# EAGLE design pic32mcj048 (EAGLE 9.6.2)
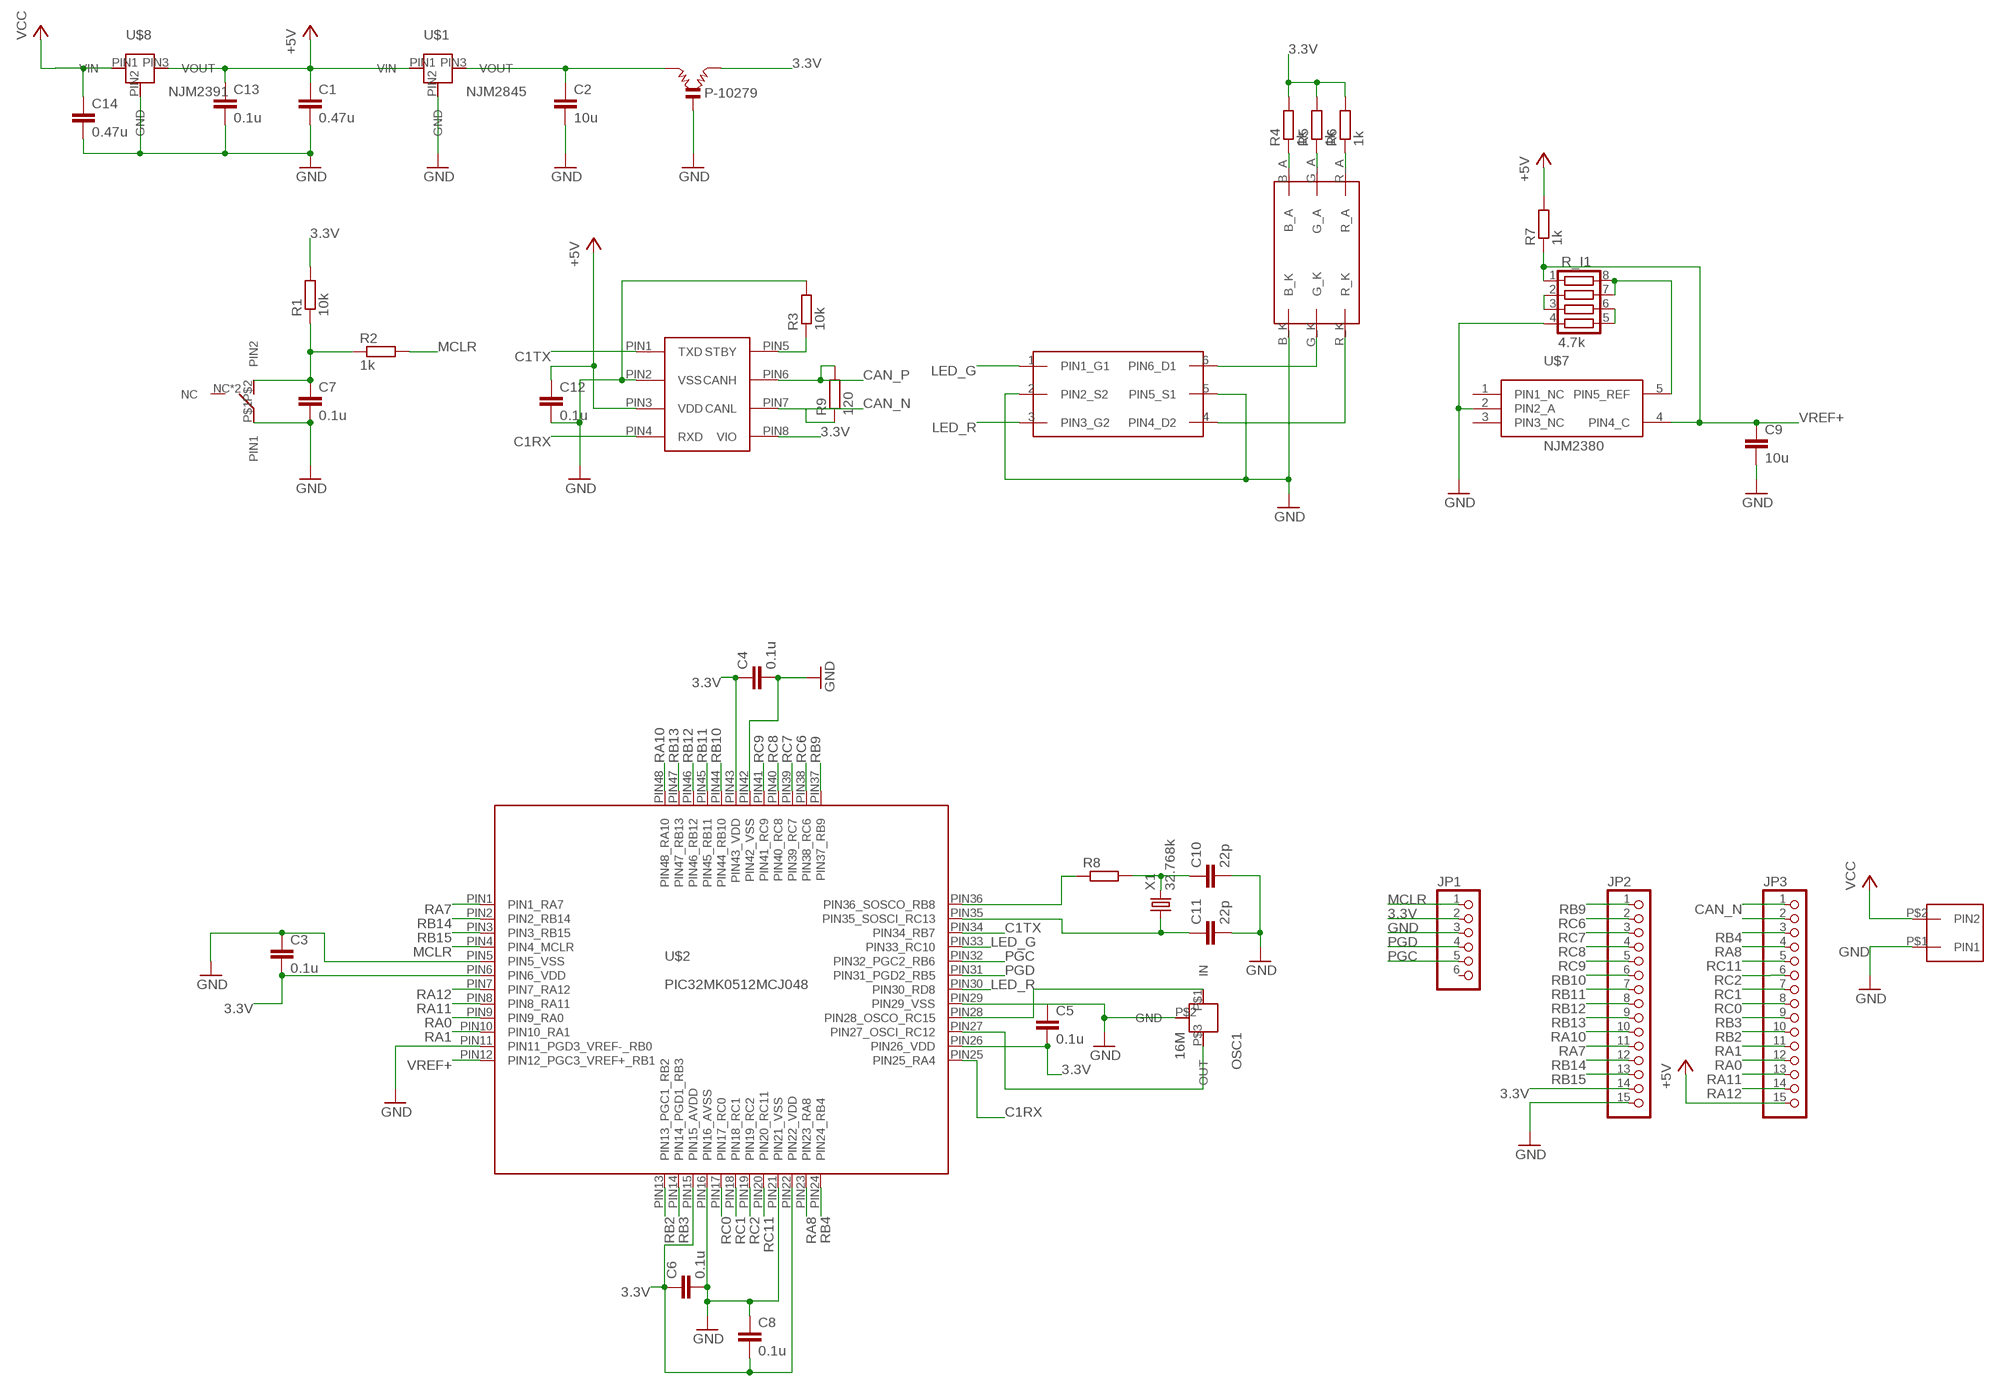
[diagram p0: schematic, sheet 1]

## Parts
C1  0.47u  C-EUC1608  [C1608]
C2  10u  C-EUC1608  [C1608]
C3  0.1u  C-EUC1608  [C1608]
C4  0.1u  C-EUC1608  [C1608]
C5  0.1u  C-EUC1608  [C1608]
C6  0.1u  C-EUC1608  [C1608]
C7  0.1u  C-EUC1608  [C1608]
C8  0.1u  C-EUC1608  [C1608]
C9  10u  C-EUC1608  [C1608]
C10  22p  C-EUC1608  [C1608]
C11  22p  C-EUC1608  [C1608]
C12  0.1u  C-EUC1608  [C1608]
C13  0.1u  C-EUC1608  [C1608]
C14  0.47u  C-EUC1608  [C1608]
IC1  MCP2562  [DIL8]
JP1  PINHD-1X6  [1X06]
JP2  PINHD-1X15  [1X15]
JP3  PINHD-1X15  [1X15]
OSC1  16M  CSTN#  [CSTNE#]
P-10279  LCL  [LCL]
R1  10k  R_REG  [1608]
R2  1k  R_REG  [1608]
R3  10k  R_REG  [1608]
R4  1k  R_REG  [1608]
R5  1k  R_REG  [1608]
R6  1k  R_REG  [1608]
R7  1k  R_REG  [1608]
R8  R_REG  [1608]
R9  120  R_REG  [1608]
R_I1  4.7k  R_SHUGOU2  [1005X4RESISTOR]
U$1  NJM2845  [TO252]
U$2  PIC32MK0512MCJ048  [LQFP48PIN]
U$3  TAKUTOSUITTI2  [TAKUTOSUITTI2]
U$4  XH_2P  [XH_2P]
U$5  RGB_LED  [RGB_LED]
U$6  FDC6305  [SSOT6]
U$7  NJM2380  [SOT23-5]
U$8  NJM2391  [TO252]
X1  32.768k  FC255  [FC255]

## Nets
3.3V: C3.2 C4.1 C5.2 C6.1 C8.2 IC1.PIN8(VIO) JP1.2 JP2.14 P-10279.2 R1.2 R4.2 R5.2 R6.2 U$2.PIN6(PIN6_VDD) U$2.PIN15(PIN15_AVDD) U$2.PIN22(PIN22_VDD) U$2.PIN26(PIN26_VDD) U$2.PIN43(PIN43_VDD)
+5V: C1.1 C12.1 C13.1 IC1.PIN3(VDD) JP3.15 R7.2 U$1.PIN1(VIN) U$8.PIN3(VOUT)
C1RX: IC1.PIN4(RXD) U$2.PIN25(PIN25_RA4)
C1TX: IC1.PIN1(TXD) U$2.PIN34(PIN34_RB7)
CAN_N: IC1.PIN7(CANL) JP3.1 R9.1
CAN_P: IC1.PIN6(CANH) JP3.2 R9.2
GND: C1.2 C2.2 C3.1 C4.2 C5.1 C6.2 C7.2 C8.1 C9.2 C10.2 C11.2 C12.2 C13.2 C14.2 IC1.PIN2(VSS) JP1.3 JP2.15 OSC1.P$2(GND) P-10279.0(GND) R3.2 R_I1.4 U$1.PIN2(GND) U$2.PIN5(PIN5_VSS) U$2.PIN11(PIN11_PGD3_VREF-_RB0) U$2.PIN16(PIN16_AVSS) U$2.PIN21(PIN21_VSS) U$2.PIN29(PIN29_VSS) U$2.PIN42(PIN42_VSS) U$3.P$1(PIN1) U$4.P$1(PIN1) U$5.B_K U$6.2(PIN2_S2) U$6.5(PIN5_S1) U$7.2(PIN2_A) U$8.PIN2(GND)
LED_G: U$2.PIN33(PIN33_RC10) U$6.1(PIN1_G1)
LED_R: U$2.PIN30(PIN30_RD8) U$6.3(PIN3_G2)
MCLR: JP1.1 R2.2 U$2.PIN4(PIN4_MCLR)
N$1: C2.1 P-10279.1 U$1.PIN3(VOUT)
N$2: C7.1 R1.1 R2.1 U$3.P$2(PIN2)
N$3: OSC1.P$1(IN) U$2.PIN28(PIN28_OSCO_RC15)
N$4: OSC1.P$3(OUT) U$2.PIN27(PIN27_OSCI_RC12)
N$5: IC1.PIN5(STBY) R3.1
N$6: C10.1 R8.2 X1.P$2
N$7: C11.1 U$2.PIN35(PIN35_SOSCI_RC13) X1.P$1
N$8: U$5.G_K U$6.6(PIN6_D1)
N$9: U$5.R_K U$6.4(PIN4_D2)
N$11: R8.1 U$2.PIN36(PIN36_SOSCO_RB8)
N$13: R4.1 U$5.B_A
N$14: R5.1 U$5.G_A
N$15: R6.1 U$5.R_A
N$21: R_I1.7 R_I1.8 U$7.5(PIN5_REF)
N$45: R_I1.2 R_I1.3
N$46: R_I1.5 R_I1.6
PGC: JP1.5 U$2.PIN32(PIN32_PGC2_RB6)
PGD: JP1.4 U$2.PIN31(PIN31_PGD2_RB5)
RA0: JP3.12 U$2.PIN9(PIN9_RA0)
RA1: JP3.11 U$2.PIN10(PIN10_RA1)
RA7: JP2.11 U$2.PIN1(PIN1_RA7)
RA8: JP3.4 U$2.PIN23(PIN23_RA8)
RA10: JP2.10 U$2.PIN48(PIN48_RA10)
RA11: JP3.13 U$2.PIN8(PIN8_RA11)
RA12: JP3.14 U$2.PIN7(PIN7_RA12)
RB2: JP3.10 U$2.PIN13(PIN13_PGC1_RB2)
RB3: JP3.9 U$2.PIN14(PIN14_PGD1_RB3)
RB4: JP3.3 U$2.PIN24(PIN24_RB4)
RB9: JP2.1 U$2.PIN37(PIN37_RB9)
RB10: JP2.6 U$2.PIN44(PIN44_RB10)
RB11: JP2.7 U$2.PIN45(PIN45_RB11)
RB12: JP2.8 U$2.PIN46(PIN46_RB12)
RB13: JP2.9 U$2.PIN47(PIN47_RB13)
RB14: JP2.12 U$2.PIN2(PIN2_RB14)
RB15: JP2.13 U$2.PIN3(PIN3_RB15)
RC0: JP3.8 U$2.PIN17(PIN17_RC0)
RC1: JP3.7 U$2.PIN18(PIN18_RC1)
RC2: JP3.6 U$2.PIN19(PIN19_RC2)
RC6: JP2.2 U$2.PIN38(PIN38_RC6)
RC7: JP2.3 U$2.PIN39(PIN39_RC7)
RC8: JP2.4 U$2.PIN40(PIN40_RC8)
RC9: JP2.5 U$2.PIN41(PIN41_RC9)
RC11: JP3.5 U$2.PIN20(PIN20_RC11)
VCC: C14.1 U$4.P$2(PIN2) U$8.PIN1(VIN)
VREF+: C9.1 R7.1 R_I1.1 U$2.PIN12(PIN12_PGC3_VREF+_RB1) U$7.4(PIN4_C)
Unconnected: JP1.6 U$3.NC U$3.NC@2(NC) U$7.1(PIN1_NC) U$7.3(PIN3_NC)

## Library data of the parts
C1-C14 = rcl:C-EU: CAPACITOR, European symbol; SPICEPREFIX: C
IC1 = user_ic:MCP2562
JP1 = pinhead:PINHD-1X6: PIN HEADER
JP2 JP3 = pinhead:PINHD-1X15: PIN HEADER
OSC1 = user_osc:CSTN#: ムラタのセラロック （セラミック振動子） 周波数はいくつか種類あり(valueで設定して) 秋月電子通商のトップ/パーツ一般/発振子/セラミック発振子 uCからのoutが入るのがinであることに注意 https://akizukidenshi.com/catalog/c/cceralock/
P-10279 = user_emifilter:LCL: FILTER; MPN: LCL; OC_FARNELL: 106331; OC_NEWARK: 06WX8509
R1-R9 = user_rcl:R_REG: チップ抵抗
R_I1 = user_rcl:R_SHUGOU
U$1 = user_ic:NJM2845: 3.3V800mA NJM2845 低ドロップアウト三端子レギュレータ 秋月電子通商[I-11299]
U$2 = user_ic:PIC32MK0512MCJ048: PIC32MK0512MCJ048 仕様 1. 定格3.3V、32bitMCU、FPU搭載、CAN-FD、QEI 2. モータコントロール向けマイコン
U$3 = user_swich:TAKUTOSUITTI2: 表面実装タクトスイッチ 秋月電子通称通販コード[P-14888]
U$4 = user_conector:XH_2P: トップ型xhコネクタ2ピン 秋月に売ってるやつ
U$5 = user_leds:RGB_LED: 秋月電子通商 I-12726
U$6 = user_tr_fet_igbt:FDC6305: デュアルNchMOSFET ゲート・ソース間絶対最大定格8v 秋月電子通商通販コード[I-06003]
U$7 = user_ic:NJM2380: njm2380af シャントレギュレータ（降伏電圧が可変可能なツナダイオードみたいなもの） ref=2.465(1%) 秋月電子通商[I-14049]
U$8 = user_ic:NJM2391: 5.5V1A NJM2845 低ドロップアウト三端子レギュレータ 秋月電子通商[I-02253]
X1 = user_osc:FC255: 表面実装水晶発振器 32,768kHzの水晶発振器 秋月電子 通販コード:P-03004

## Board
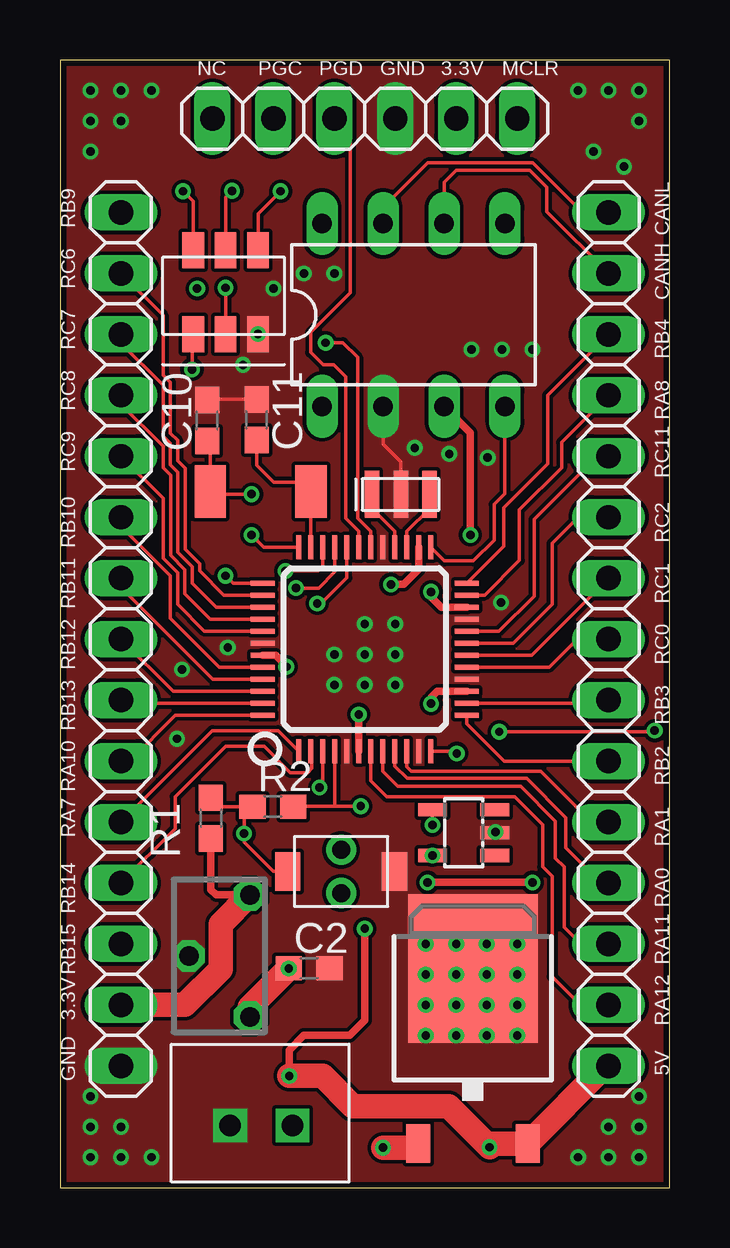
[diagram p1: board, top side]
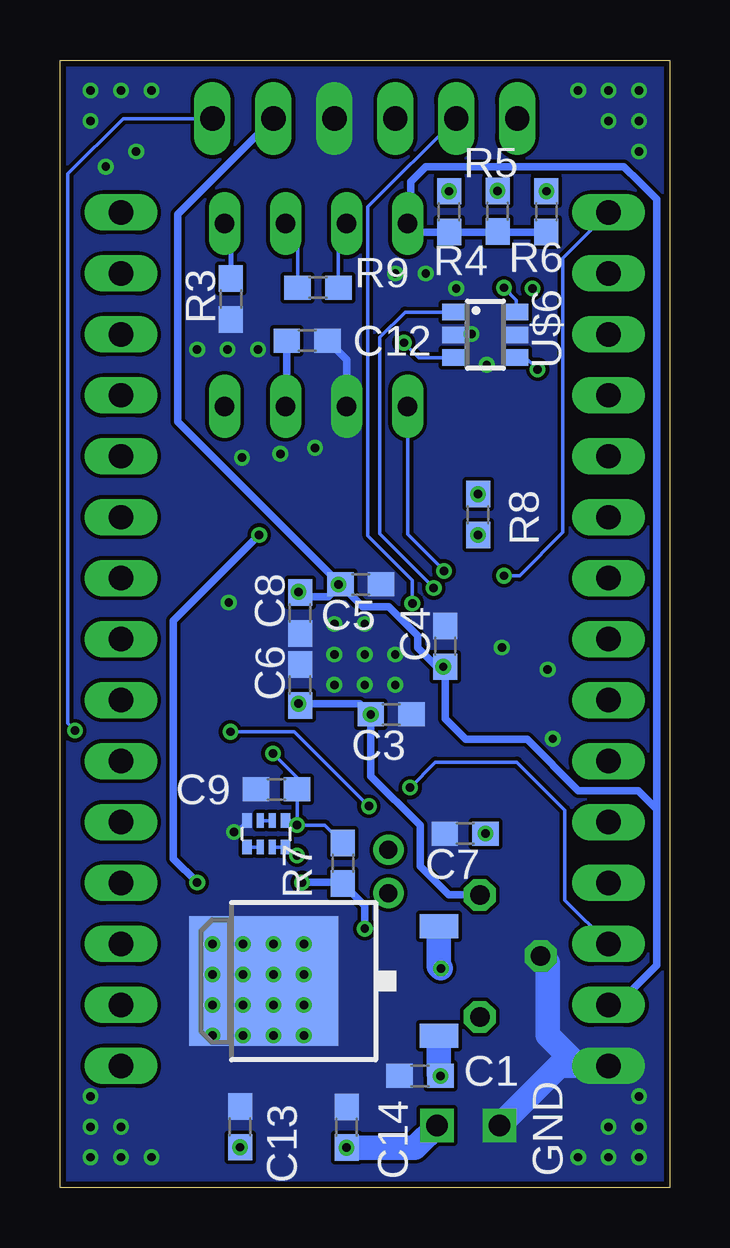
[diagram p2: board, bottom side, seen from below]

Size 25.4 x 46.99 mm. Coordinates in mm from the lower left corner, seen from the top.
Outline: 0,0 25.4,0 25.4,46.99 0,46.99 0,0
Copper layers (1*16): Top 0.035mm / dielectric 1.5mm / Bottom 0.035mm
Design rules "SeeedStudio_2layer_DRU_no_angle_20140221": minimum track width 6mil, minimum drill 12mil, track to track 6mil, track to pad 6mil, pad to pad 6mil, via to via 6mil, smd to smd 0mil, copper to edge 10mil, drill to drill 10mil, minimum pad ring 10mil, minimum via ring 6mil, stop-mask expansion 2mil, vias tented up to drill 100mil, thermal gap 10mil

### Footprints (pad centres in the part's own frame; a part is rotated, then mirrored left to right if it is on the bottom)
C1608 = smd 1.1 x 1: 1 -0.85,0; 2 0.85,0
DIL8 = drill 0.813 long: PIN1 -3.81,-3.81; PIN2 -1.27,-3.81; PIN3 1.27,-3.81; PIN4 3.81,-3.81; PIN5 3.81,3.81; PIN6 1.27,3.81; PIN7 -1.27,3.81; PIN8 -3.81,3.81
1X06 = drill 1.016 long: 1 -6.35,0; 2 -3.81,0; 3 -1.27,0; 4 1.27,0; 5 3.81,0; 6 6.35,0
1X15 = drill 1.016 long: 1 -17.78,0; 2 -15.24,0; 3 -12.7,0; 4 -10.16,0; 5 -7.62,0; 6 -5.08,0; 7 -2.54,0; 8 0,0; 9 2.54,0; 10 5.08,0; 11 7.62,0; 12 10.16,0; 13 12.7,0; 14 15.24,0; 15 17.78,0
CSTNE# = smd 0.6 x 1.95: P$1 0,0; P$2 1.2,0; P$3 2.4,0
LCL = drill 0.813 octagon: 0 0,1.27; 1 -2.54,-1.27; 2 2.54,-1.27
1608 = smd 1.1 x 1: 1 -0.85,0; 2 0.85,0
1005X4RESISTOR = smd 0.4 x 0.6: 1 0.2,-0.8; 4 1.8,-0.8; 5 1.8,0.3; 8 0.2,0.3 | smd 0.3 x 0.6: 2 0.75,-0.8; 3 1.25,-0.8; 6 1.25,0.3; 7 0.75,0.3
TO252 = smd 1 x 1.6: PIN1 -2.28,-4.8; PIN3 2.28,-4.8 | smd 5.4 x 6.2: PIN2 0,2.5
LQFP48PIN = smd 0.2 x 1: PIN1 -2.75,-4.25; PIN2 -2.25,-4.25; PIN3 -1.75,-4.25; PIN4 -1.25,-4.25; PIN5 -0.75,-4.25; PIN6 -0.25,-4.25; PIN7 0.25,-4.25; PIN8 0.75,-4.25; PIN9 1.25,-4.25; PIN10 1.75,-4.25; PIN11 2.25,-4.25; PIN12 2.75,-4.25; PIN25 2.75,4.25; PIN26 2.25,4.25; PIN27 1.75,4.25; PIN28 1.25,4.25; PIN29 0.75,4.25; PIN30 0.25,4.25; PIN31 -0.25,4.25; PIN32 -0.75,4.25; PIN33 -1.25,4.25; PIN34 -1.75,4.25; PIN35 -2.25,4.25; PIN36 -2.75,4.25 | smd 1 x 0.2: PIN13 4.25,-2.75; PIN14 4.25,-2.25; PIN15 4.25,-1.75; PIN16 4.25,-1.25; PIN17 4.25,-0.75; PIN18 4.25,-0.25; PIN19 4.25,0.25; PIN20 4.25,0.75; PIN21 4.25,1.25; PIN22 4.25,1.75; PIN23 4.25,2.25; PIN24 4.25,2.75; PIN37 -4.25,2.75; PIN38 -4.25,2.25; PIN39 -4.25,1.75; PIN40 -4.25,1.25; PIN41 -4.25,0.75; PIN42 -4.25,0.25; PIN43 -4.25,-0.25; PIN44 -4.25,-0.75; PIN45 -4.25,-1.25; PIN46 -4.25,-1.75; PIN47 -4.25,-2.25; PIN48 -4.25,-2.75
TAKUTOSUITTI2 = drill 0.75: NC 2.225,-0.9; NC@2 2.225,0.9 | smd 1.05 x 1.6: P$1 0,0; P$2 4.45,0
XH_2P = drill 0.9 square: P$1 2.45,2.35; P$2 5.05,2.35
RGB_LED = smd 1.5 x 0.9: B_A 3.5,-2.7; B_K 0,-2.7; G_A 3.5,-1.35; G_K 0,-1.35; R_A 3.5,0; R_K 0,0
SSOT6 = smd 0.69 x 0.99: 1 -0.95,-1.3; 2 0,-1.3; 3 0.95,-1.3; 4 0.95,1.3; 5 0,1.3; 6 -0.95,1.3
SOT23-5 = smd 0.55 x 1.2: 1 -0.95,-1.3; 2 0,-1.3; 3 0.95,-1.3; 4 0.95,1.3; 5 -0.95,1.3
FC255 = smd 1.3 x 2.2: P$1 0,0; P$2 4.2,0

### Placement (x,y rotation side)
C1  10.4,4.66 180 bottom
C2  10.38,9.14 0 top
C3  11.6,19.72 180 bottom
C4  9.34,22.56 90 bottom
C5  12.87,25.14 180 bottom
C6  15.39,20.95 90 bottom
C7  8.52,14.76 180 bottom
C8  15.39,23.95 90 bottom
C9  16.38,16.6 180 bottom
C10  6.13,31.97 90 top
C11  8.2,32 90 top
C12  15.1,35.29 0 bottom
C13  17.9,2.54 90 bottom
C14  13.46,2.52 90 bottom
IC1  14.73,36.37 0 top
JP1  12.7,44.55 180 top
JP2  2.54,22.86 270 top
JP3  22.86,22.86 270 top
OSC1  13,28.9 0 top
P-10279  6.64,9.66 90 top
R1  6.28,15.4 270 top
R2  8.87,15.88 0 top
R3  18.29,37.03 270 bottom
R4  9.19,40.67 270 bottom
R5  7.17,40.69 270 bottom
R6  5.13,40.67 270 bottom
R7  13.62,13.52 270 bottom
R8  7.98,28.05 90 bottom
R9  14.65,37.51 180 bottom
R_I1  15.8,14.49 180 bottom
U$1  14.41,8.61 90 bottom
U$2  12.7,22.44 0 top
U$3  13.94,13.18 180 top
U$4  4.64,0.24 0 top
U$5  5.55,35.57 90 top
U$6  7.68,35.54 270 bottom
U$7  16.82,14.79 90 top
U$8  17.2,6.64 0 top
X1  10.46,29.01 180 top

### Tracks (layer width: path | path; a pad name or v marks a point on that pad's centre or on a via)
3.3V  (via drill 0.35)
  Top 0.305: P-10279.2 6.5,12.2 6.28,12.42 R1.2 | v9.43,21.71 9.26,21.89 9.26,21.92 8.98,22.19 U$2.PIN43 | U$2.PIN26 14.95,25.77 14.32,25.14 v13.79,25.14 | v15.46,24.83 15.46,24.61 15.88,24.19 U$2.PIN22 | v15.46,20.17 15.46,20.43 15.72,20.69 U$2.PIN15 | C3.2 U$2.PIN6
  Top 1.016: P-10279.2 6.69,10.98 6.69,9.11 5.2,7.62 JP2.14
  Bottom 0.305: C4.1 9.34,19.54 8.49,18.69 5.94,18.69 3.8,16.55 1.32,16.55 0.54,15.77 | C4.1 v9.43,21.71 | P-10279.2 9.2,12.2 10.4,13.4 10.4,15.1 12.45,17.15 C3.2 12.9,20.17 v15.46,20.17 C6.1 | C5.2 14.23,24.63 15.26,24.63 v15.46,24.83 15.43,24.8 C8.2 | C4.1 9.71,21.71 10.5,22.5 10.5,23 11.7,24.2 12.78,24.2 C5.2 | C6.1 | C5.2 20.49,31.91 20.49,40.57 JP1.2 | R6.2 7.15,39.82 R5.2 7.19,39.82 R4.2 10.56,39.82 IC1.PIN8 10.79,40.3 10.79,41.91 10.16,42.55 1.91,42.55 1.27,41.91 0.54,41.18 0.54,15.77 | C5.2 v13.79,25.14 | JP2.14 2.19,7.62 0.54,9.27 0.54,15.24 0.54,15.77
  other vias: 12.45,19.72
+5V  (via drill 0.35)
  Top 0.305: IC1.PIN3 17.1,31.46 v17.1,27.2 | C1.1 9.55,5.74 10.16,6.35 12.06,6.35 12.7,6.99 v12.7,10.79 | v15.31,12.72 v19.68,12.72
  Top 1.016: C1.1 10.94,4.66 12.2,3.4 16.19,3.4 C13.1 18.05,1.84 U$8.PIN3 22.72,5.08 JP3.15
  Bottom 0.305: C12.1 15.95,32.61 IC1.PIN3 | v17.1,27.2 20.68,23.62 20.68,13.71 v19.68,12.72 | v12.7,10.79 12.7,11.75 R7.2 13.67,12.72 v15.31,12.72
  Bottom 1.016: C1.1 9.61,4.72 U$1.PIN1
  other vias: 17.9,1.69 9.55,4.66
C1RX
  Top 0.152: IC1.PIN4 18.54,28.92 18.09,28.47 18.09,26.99 17.22,26.12 16.02,26.12 U$2.PIN25
C1TX  (via drill 0.35)
  Top 0.152: U$2.PIN34 10.95,25.88 10.77,25.7 v9.4,25.7
  Bottom 0.152: IC1.PIN1 10.92,27.22 v9.4,25.7
CAN_N
  Top 0.152: JP3.1 21.76,40.64 19.7,42.7 15.32,42.7 13.62,40.99 13.62,40.34 IC1.PIN7
  Bottom 0.152: R9.1 13.8,39.84 IC1.PIN7
CAN_P
  Top 0.152: JP3.2 20.28,40.68 20.28,41.68 19.57,42.4 16.5,42.4 16,41.9 IC1.PIN6
  Bottom 0.152: R9.2 15.5,39.68 IC1.PIN6
GND  (via drill 0.35)
  Top 0.152: U$7.2 v18.15,14.82 | C11.2 6.16,32.85 C10.2 | OSC1.P$2 14.2,30.25 13.46,30.99 IC1.PIN2
  Bottom 0.152: U$6.2 8.28,35.54 U$5.B_K | R_I1.4 18.07,14.82 v18.15,14.82
  Bottom 0.305: C12.2 13.46,34.5 IC1.PIN2
  Bottom 1.016: P-10279.0 5.08,9.37 5.08,6.35 3.81,5.08 JP2.15 4.6,5.08 U$4.P$1
  other vias: 15.24,6.35 16.51,6.35 17.78,6.35 19.05,6.35 19.05,7.62 17.78,7.62 16.51,7.62 15.24,7.62 19.05,8.89 17.78,8.89 16.51,8.89 15.24,8.89 19.05,10.16 17.78,10.16 16.51,10.16 15.24,10.16 8.25,35.57 5.08,21.59 11.43,20.95 12.7,20.95 13.97,20.95 13.97,22.23 12.7,22.23 11.43,22.23 12.7,23.5 13.97,23.5 1.27,1.27 2.54,1.27 3.81,1.27 2.54,2.54 1.27,2.54 1.27,3.81 21.59,1.27 22.86,1.27 24.13,1.27 24.13,2.54 22.86,2.54 24.13,3.81 18.37,24.38 19.68,34.92 18.41,34.92 17.14,34.92 17.82,30.42 16.22,30.58 14.78,30.83 23.5,42.55 22.23,43.18 24.13,44.45 24.13,45.72 22.86,45.72 21.59,45.72 1.27,43.18 1.27,44.45 2.54,44.45 2.54,45.72 3.81,45.72 1.27,45.72 8.89,37.47 10.16,38.1 11.43,38.1 7.62,34.29 4.87,18.71 6.99,22.51
  pour Top (no thermals): -1.27,48.26 26.67,48.26 26.67,-1.27 -1.27,-1.27
  pour Bottom (no thermals): -2.54,49.53 27.94,49.53 27.94,-2.54 -2.54,-2.54
  pour Top: 10.16,26.67 11.43,26.67 11.43,30.48 9.32,30.48 9.3,30.5 9.3,32.2 5.2,32.2 5.2,30.7 5.2,30.6 5.4,30.4 5.5,30.3 5.5,27.9 5.8,27.6 6.7,26.7 6.73,26.67
  pour Bottom: 8.89,26.67 11.43,26.67 11.43,30.48 9.32,30.48 9.3,30.5 9.3,32.2 5.2,32.2 5.2,30.6 5.5,30.3 5.5,27.9 6.7,26.7 6.73,26.67
  pour Bottom: 13.97,26.67 14.57,26.67 16,28.1 16,30 12.4,30 12.4,28.1 13.8,26.7 13.83,26.67
  pour Top: 13.97,26.67 14.57,26.67 16,28.1 16,30 12.4,30 12.4,28.1 13.8,26.7 13.83,26.67
LED_G  (via drill 0.35)
  Top 0.152: U$2.PIN33 11.45,25.66 10.78,24.99 v9.83,24.99
  Bottom 0.152: v9.83,24.99 9.83,25.01 12.08,27.26 12.08,35.43 11.02,36.49 U$6.1
LED_R  (via drill 0.35)
  Top 0.152: U$2.PIN30 12.95,27.35 12.4,27.9 12.4,34.6 11.79,35.21 v11.07,35.21
  Bottom 0.152: U$6.3 10.45,34.59 v11.07,35.21
MCLR  (via drill 0.35)
  Top 0.152: R2.2 9.96,15.88 9.98,15.9 11.43,15.9 | v24.78,19.05 24.73,19 v18.3,19 | v12.53,15.9 11.43,15.9 | 11.43,15.9 11.45,15.92 U$2.PIN4
  Bottom 0.152: JP1.1 22.76,44.55 25.07,42.24 25.07,19.35 v24.78,19.05 | v18.3,19 15.63,19 v12.53,15.9
N$1  (via drill 0.35)
  Top 1.016: C2.1 7.91,7.52 P-10279.1
  Bottom 1.016: U$1.PIN3 9.61,9.22 C2.1
  other vias: 9.53,9.14
N$2  (via drill 0.35)
  Top 0.152: R1.1 6.65,15.88 R2.1 7.67,15.53 C7.1 7.67,14.4 8.89,13.18 U$3.P$2
  other vias: 7.67,14.76
N$3
  Top 0.152: U$2.PIN28 13.95,27.35 13,28.3 OSC1.P$1
N$4
  Top 0.152: U$2.PIN27 14.45,27.35 15.4,28.3 OSC1.P$3
N$5
  Bottom 0.203: IC1.PIN5 18.29,40.18 R3.1
N$6  (via drill 0.35)
  Top 0.152: R8.2 6.37,28.9 X1.P$2 6.26,30.99 C10.1
  other vias: 7.98,28.9
N$7
  Top 0.152: U$2.PIN35 X1.P$1 10.07,29.4 8.9,29.4 8.2,30.1 C11.1
N$8  (via drill 0.35)
  Top 0.152: v6.9,37.5 U$5.G_K
  Bottom 0.152: U$6.6 6.38,36.98 v6.9,37.5
N$9  (via drill 0.35)
  Top 0.152: v5.5,34.1 5.5,35.52 U$5.R_K
  Bottom 0.152: U$6.4 5.99,34.59 v5.5,34.1
N$11  (via drill 0.35)
  Top 0.152: U$2.PIN36 8.49,26.69 R8.1
  other vias: 7.98,27.2
N$13  (via drill 0.35)
  Top 0.152: U$5.B_A 8.25,40.58 R4.1
  other vias: 9.19,41.52
N$14  (via drill 0.35)
  Top 0.152: U$5.G_A 6.9,41.27 R5.1
  other vias: 7.17,41.54
N$15  (via drill 0.35)
  Top 0.152: U$5.R_A 5.55,41.1 R6.1
  other vias: 5.13,41.52
N$21  (via drill 0.35)
  Bottom 0.152: U$7.5 15.65,13.85 R_I1.8 R_I1.7
  other vias: 15.52,13.85
N$40  (via drill 0.35)
  other vias: 5.71,37.47
N$45
  Bottom 0.152: R_I1.3 R_I1.2
N$46
  Bottom 0.152: R_I1.5 R_I1.6
PGC  (via drill 0.35)
  Top 0.152: v10.72,24.35 10.89,24.35 11.95,25.41 U$2.PIN32
  Bottom 0.152: v10.72,24.35 10.72,25.31 12.57,27.16 12.57,40.87 JP1.5
PGD
  Top 0.152: JP1.4 12.1,43.66 12.1,37.3 10.44,35.64 10.44,34.81 10.96,34.29 11.41,34.29 11.91,33.79 11.91,27.89 12.45,27.35 U$2.PIN31
RA0
  Top 0.152: U$2.PIN9 13.95,17.57 14.46,17.05 19.45,17.05 21.08,15.43 21.08,14.16 22.54,12.7 JP3.12
RA1
  Top 0.152: U$2.PIN10 14.45,17.55 14.64,17.36 20.04,17.36 22.16,15.24 JP3.11
RA7
  Top 0.152: U$2.PIN1 9.09,19.05 6.35,19.05 JP2.11
RA8
  Top 0.152: U$2.PIN23 17.69,24.69 19.14,26.14 19.14,28.25 20.9,30 20.9,31.06 JP3.4
RA10
  Top 0.152: U$2.PIN48 4.81,19.69 2.9,17.78 JP2.10
RA11
  Top 0.152: U$2.PIN8 13.45,17.35 14.08,16.72 19.2,16.72 20.64,15.28 20.64,13.74 21,13.38 21,10.85 21.69,10.16 JP3.13
RA12
  Top 0.152: U$2.PIN7 12.95,16.95 13.62,16.29 18.95,16.29 20.11,15.13 20.11,13.38 20.5,12.98 20.5,8.8 21.68,7.62 JP3.14
RB2
  Top 0.152: U$2.PIN13 16.95,19.33 18.5,17.78 JP3.10
RB3
  Top 0.152: U$2.PIN14 22.73,20.19 JP3.9
RB4
  Top 0.152: U$2.PIN24 18.5,26.73 18.5,28.34 20.32,30.16 20.32,33.02 JP3.3
RB9  (via drill 0.35)
  Top 0.152: U$2.PIN37 7.21,25.19 v6.9,25.5
  Bottom 0.152: JP2.1 4.45,38.73 4.45,27.3 6.25,25.5 v6.9,25.5
RB10
  Top 0.152: U$2.PIN44 6.64,21.69 4.6,23.73 4.6,25.51 2.54,27.56 JP2.6
RB11
  Top 0.152: U$2.PIN45 6.37,21.19 2.54,25.02 JP2.7
RB12
  Top 0.152: U$2.PIN46 4.71,20.69 JP2.8
RB13
  Top 0.152: JP2.9 2.67,20.19 U$2.PIN47
RB14
  Top 0.152: U$2.PIN2 10.49,18.15 10.49,17.47 10.32,17.3 9.6,17.3 8.5,18.4 6.9,18.4 4.8,16.3 4.8,14.96 JP2.12
RB15  (via drill 0.35)
  Top 0.152: v10.81,16.67 10.95,16.81 U$2.PIN3
  Bottom 0.152: JP2.13 4.36,11.98 4.36,15.73 6.36,17.73 9.76,17.73 v10.81,16.67
RC0
  Top 0.152: U$2.PIN17 20.39,21.69 21.56,22.86 JP3.8
RC1
  Top 0.152: U$2.PIN18 19.65,22.19 JP3.7
RC2
  Top 0.152: U$2.PIN19 18.88,22.69 20.5,24.31 20.5,26.85 21.59,27.94 JP3.6
RC6
  Top 0.152: JP2.2 4.29,36.35 4.29,33.86 4.6,33.56 4.6,31.45 4.9,31.14 4.9,30.3 5.21,29.99 5.21,26.61 5.82,26.01 5.82,25.7 6.83,24.69 U$2.PIN38
RC7
  Top 0.152: U$2.PIN39 6.5,24.19 5.51,25.18 5.51,25.88 4.91,26.49 4.91,29.82 4.6,30.13 4.6,31.02 4.29,31.32 4.29,33.43 2.54,35.18 JP2.3
RC8
  Top 0.152: U$2.PIN40 6.26,23.69 5.21,24.74 5.21,25.76 4.61,26.36 4.61,29.7 4.29,30.01 4.29,30.89 2.54,32.64 JP2.4
RC9
  Top 0.152: U$2.PIN41 6.02,23.19 4.9,24.31 4.9,25.63 4.3,26.23 4.3,28.72 JP2.5
RC11
  Top 0.152: U$2.PIN20 18.29,23.19 19.75,24.65 19.75,27.85 22.38,30.48 JP3.5
VCC  (via drill 0.35)
  Top 1.016: C14.1 14.75,1.67 U$8.PIN1
  Bottom 1.016: U$4.P$2 10.61,1.67 C14.1
  other vias: 13.46,1.67
VREF+  (via drill 0.35)
  Top 0.152: U$2.PIN12 16.44,18.19 v16.53,18.1 | v15.52,15.11 U$7.4
  Bottom 0.152: R7.1 14.36,15.11 v15.52,15.11 | v15.52,15.11 C9.1 15.53,17.1 v16.53,18.1 | v15.52,15.11 15.71,15.29 R_I1.1

### Text on the board
tPlace: NC | PGC | PGD | GND | 3.3V | MCLR | CANL | RB9 | CANH | RC6 | RB4 | RC7 | RA8 | RC8 | RC11 | RC9 | RC2 | RB10 | RC1 | RB11 | RC0 | RB12 | RB3 | RB13 | RB2 | RA10 | RA1 | RA7 | RA0 | RB14 | RA11 | RB15 | RA12 | 3.3V | 5V | GND
bPlace: GND